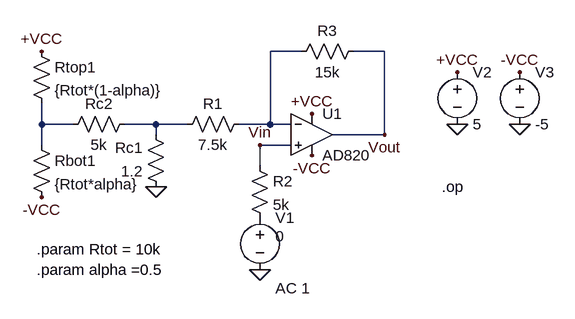
[diagram p0: schematic OP1.asc]
OP1.asc, the LTspice schematic file:
Version 4.1
SHEET 1 880 680
WIRE 208 0 160 0
WIRE 336 0 288 0
WIRE -192 112 -192 80
WIRE -144 112 -192 112
WIRE -16 112 -64 112
WIRE 32 112 -16 112
WIRE 160 112 160 0
WIRE 160 112 112 112
WIRE 192 112 160 112
WIRE -16 128 -16 112
WIRE 336 128 336 0
WIRE 336 128 256 128
WIRE -192 144 -192 112
WIRE 192 144 144 144
WIRE 144 176 144 144
FLAG -16 208 0
FLAG 448 112 0
FLAG 544 112 0
FLAG 144 336 0
FLAG 448 32 +VCC
FLAG 224 96 +VCC
FLAG -192 0 +VCC
FLAG 544 32 -VCC
FLAG 224 160 -VCC
FLAG -192 224 -VCC
FLAG 144 144 Vin
FLAG 336 128 Vout
DATAFLAG 320 128 ""
DATAFLAG 144 176 ""
DATAFLAG -16 112 ""
SYMBOL OpAmps\\AD820 224 64 R0
SYMATTR InstName U1
SYMBOL res 128 96 R90
WINDOW 0 0 56 VBottom 2
WINDOW 3 32 56 VTop 2
SYMATTR InstName R1
SYMATTR Value 7.5k
SYMBOL res 0 224 R180
WINDOW 0 36 76 Left 2
WINDOW 3 36 40 Left 2
SYMATTR InstName Rc1
SYMATTR Value 1.2
SYMBOL res -160 128 R270
WINDOW 0 32 56 VTop 2
WINDOW 3 0 56 VBottom 2
SYMATTR InstName Rc2
SYMATTR Value 5k
SYMBOL res -208 -16 R0
SYMATTR InstName Rtop1
SYMATTR Value {Rtot*(1-alpha)}
SYMBOL res -208 128 R0
SYMATTR InstName Rbot1
SYMATTR Value {Rtot*alpha}
SYMBOL res 128 160 R0
SYMATTR InstName R2
SYMATTR Value 5k
SYMBOL res 304 -16 R90
WINDOW 0 0 56 VBottom 2
WINDOW 3 32 56 VTop 2
SYMATTR InstName R3
SYMATTR Value 15k
SYMBOL voltage 144 240 R0
WINDOW 123 24 124 Left 2
WINDOW 39 0 0 Left 0
WINDOW 3 24 44 Left 2
SYMATTR Value2 AC 1
SYMATTR Value 0
SYMATTR InstName V1
SYMBOL voltage 448 16 R0
SYMATTR InstName V2
SYMATTR Value 5
SYMBOL voltage 544 16 R0
SYMATTR InstName V3
SYMATTR Value -5
TEXT -200 304 Left 2 !.param Rtot = 10k
TEXT -200 336 Left 2 !.param alpha =0.5
TEXT 424 208 Left 2 !.op

The netlist it stands for:
* OP1.asc
X§U1 Vin N001 +VCC -VCC Vout AD820  ; pins In+ In- V+ V- OUT
R1 N001 N003 7.5k
Rc1 0 N003 1.2
Rc2 N002 N003 5k
Rtop1 +VCC N002 {Rtot*(1-alpha)}
Rbot1 N002 -VCC {Rtot*alpha}
R2 Vin P001 5k
R3 Vout N001 15k
V1 P001 0 0 AC 1
V2 +VCC 0 5
V3 -VCC 0 -5
.param Rtot = 10k
.param alpha =0.5
.op
.backanno
.end